# Altium schematic sheet Balancer Robot.SchDoc
size A4
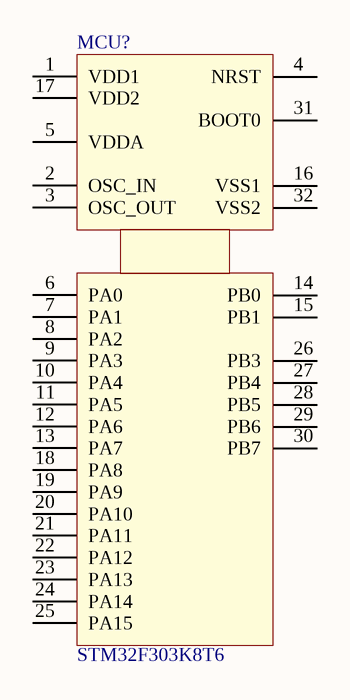
[diagram p0: Balancer Robot.SchDoc]

## Parts
MCU?  STM32F303K8T6  [LQFP-32]

## Nets

Not connected (* = marked no-connect by the designer): MCU? 1(VDD1) 2(OSC_IN) 3(OSC_OUT) 4(NRST) 5(VDDA) 6(PA0) 7(PA1) 8(PA2) 9(PA3) 10(PA4) 11(PA5) 12(PA6) 13(PA7) 14(PB0) 15(PB1) 16(VSS1) 17(VDD2) 18(PA8) 19(PA9) 20(PA10) 21(PA11) 22(PA12) 23(PA13) 24(PA14) 25(PA15) 26(PB3) 27(PB4) 28(PB5) 29(PB6) 30(PB7) 31(BOOT0) 32(VSS2)

## Library data of the parts
MCU? = STM32F303K8T6: 32-Bit Mikrocontroller; Manufacturer: STMicroelectronics; Part Number: STM32F303K8T6; Supplier 1: Mouser; Supplier 1 Part Number: 511-STM32F303K8T6; Price: 4.18